# Altium schematic sheet Battery_Interface.SchDoc
size A4; Organization: TESLA Motors, INC; Address1: 3500 Deer Creek Road; Address2: Palo Alto, CA; Address4: U.S.A.; SheetNumber: 2; SheetTotal: 7
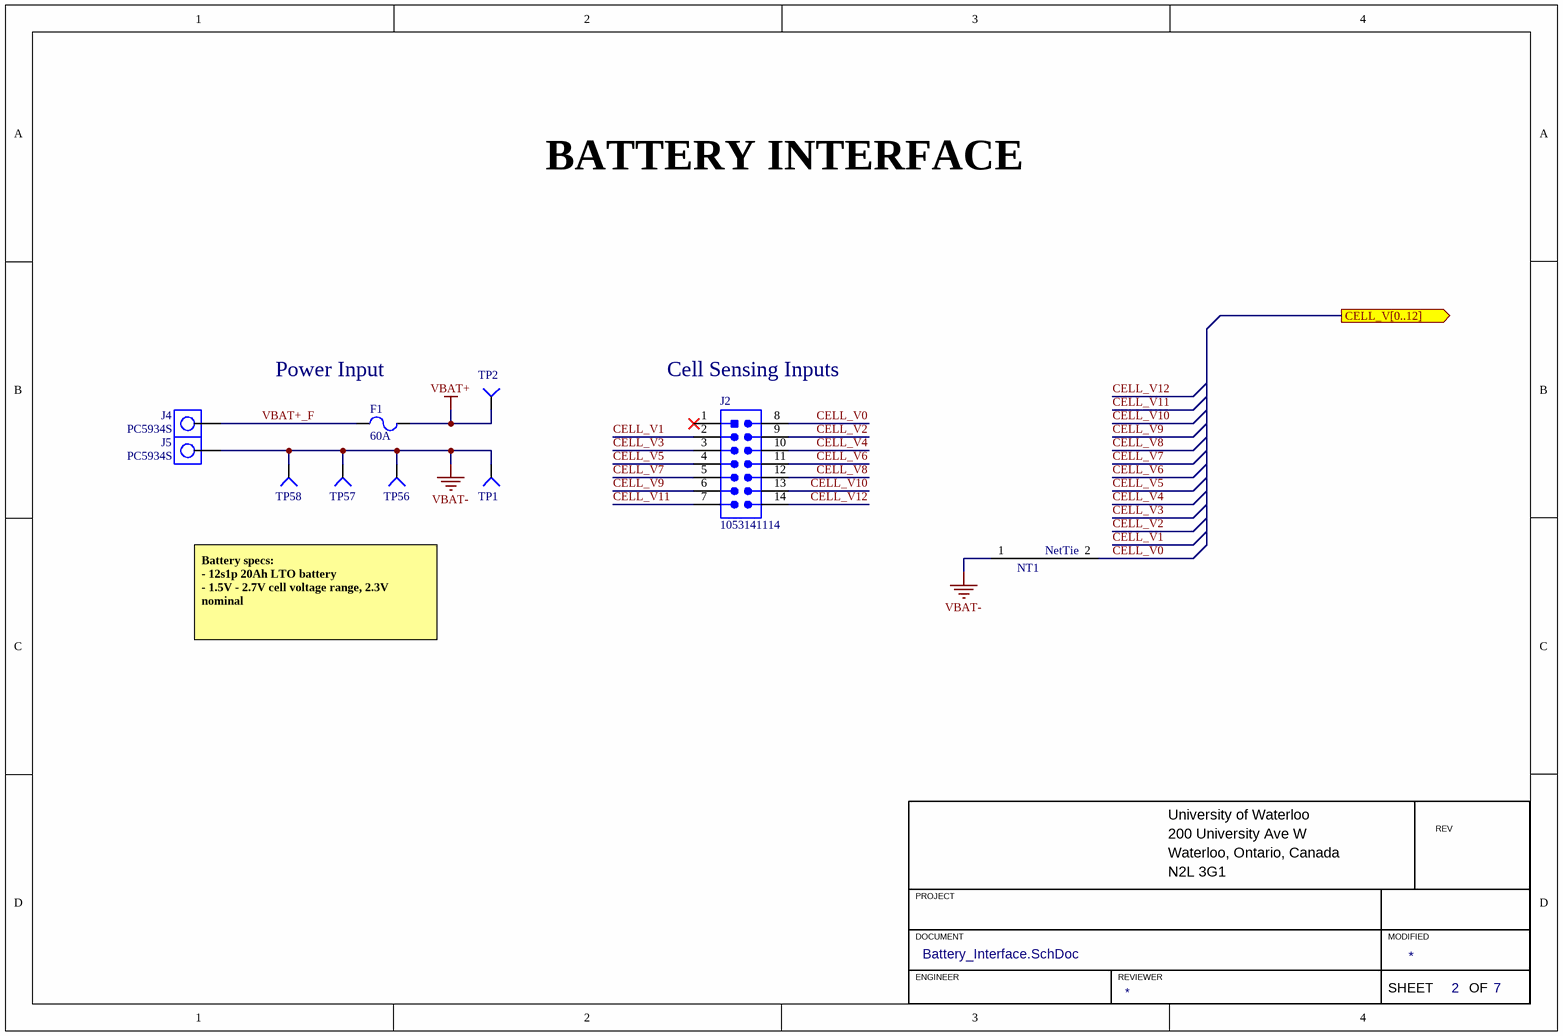
[diagram p0: Battery_Interface.SchDoc]

## Parts
F1  Current Rating: 60A  [FUSE_456SDE_LITTLEFUSE]  (hidden comment: FUSE_60A_LITTLEFUSE)
J2  1053141114  [MOLEX-NANOFIT 7x2 THRA]
J4  Manufacturer Part Number 1: PC5934S  [APP_PC5934S]  (hidden comment: CON_1POS_APP75)
J5  Manufacturer Part Number 1: PC5934S  [APP_PC5934S]  (hidden comment: CON_1POS_APP75)
NT1  NetTie  [NET_TIE]  (value not drawn)
TP1  TESTPOINT_SMD_LOOP  [S1751-46R]  (value not drawn)
TP2  TESTPOINT_SMD_LOOP  [S1751-46R]  (value not drawn)
TP56  TESTPOINT_SMD_LOOP  [S1751-46R]  (value not drawn)
TP57  TESTPOINT_SMD_LOOP  [S1751-46R]  (value not drawn)
TP58  TESTPOINT_SMD_LOOP  [S1751-46R]  (value not drawn)

## Ports
CELL_V[0..12] (out)

## Nets
VBAT+: F1.2 TP2.1(=value)
VBAT-: J5.1 NT1.1 TP1.1(=value) TP56.1(=value) TP57.1(=value) TP58.1(=value)
CELL_V0: J2.8 NT1.2
CELL_V1: J2.2
CELL_V2: J2.9
CELL_V3: J2.3
CELL_V4: J2.10
CELL_V5: J2.4
CELL_V6: J2.11
CELL_V7: J2.5
CELL_V8: J2.12
CELL_V9: J2.6
CELL_V10: J2.13
CELL_V11: J2.7
CELL_V12: J2.14
VBAT+_F: F1.1 J4.1

Not connected (* = marked no-connect by the designer): J2 1*

## Notes on the sheet
- BATTERY INTERFACE
- (near F1) Power Input
- (near J2) Cell Sensing Inputs
- Battery specs:
  - 12s1p 20Ah LTO battery
  - 1.5V - 2.7V cell voltage range, 2.3V nominal
- University of Waterloo
- 200 University Ave W
- REV
- PROJECT
- Waterloo, Ontario, Canada
- N2L 3G1
- DOCUMENT
- ENGINEER
- REVIEWER
- MODIFIED
- SHEET
- OF

## Library data of the parts
F1 = FUSE_60A_LITTLEFUSE: FUSE BRD MT 60A 250VAC 80VDC SMD; Manufacturer 1: Littelfuse Inc.; Manufacturer Part Number 1: 0456060.DRSDE; Mounting Type: SMD; Verified: No; Supplier 1: Digi-Key; Supplier Part Number 1: 18-0456060.DRSDECT-ND
J2 = CON_MOLEX-NANOFIT_7x2_THRA: CONN HEADER R/A 14POS 2.5MM; Manufacturer 1: Molex; Voltage Rating: 250V; Current Rating: 7.5A; Pitch: 2.5mm; Supplier 1: Digi-Key; Supplier Part Number 1: WM16912-ND; Manufacturer Part Number 1: 1053141114
J4 J5 = CON_1POS_APP75: TERM BLADE NON-GEND SILVER; Manufacturer 1: Anderson Power Products, Inc.; Voltage Rating: 600V; Current Rating: 55A; Supplier 1: Digi-Key; Supplier Part Number 1: 2243-PC5934S-ND
TP1 TP2 TP56-TP58 = TESTPOINT_SMD_LOOP: TESTPOINT SMD LOOP; Manufacturer 1: Harwin; Supplier 1: Digi-Key; Manufacturer Part Number 1: S1751-46R; Mounting Type: SMD; Package/Footprint: SMD; Supplier Part Number 1: 952-1478-1-ND